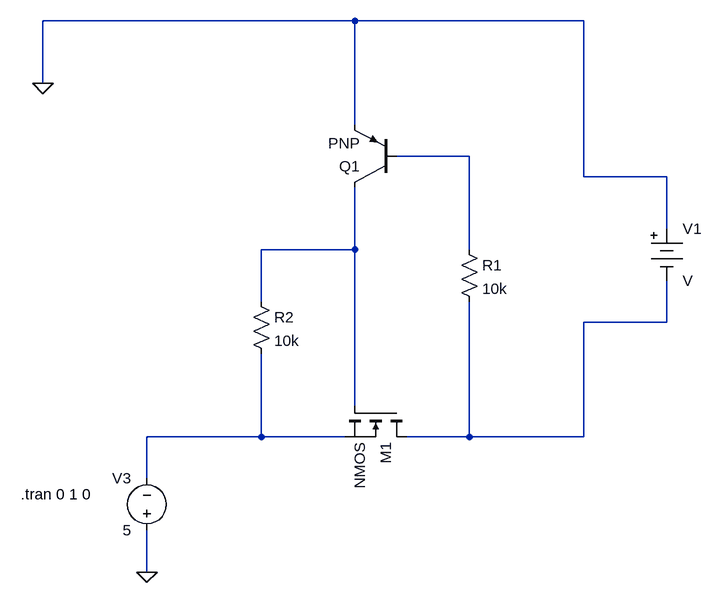
[diagram p0: schematic reverse_voltage_protection_nmos.asc]
reverse_voltage_protection_nmos.asc, the LTspice schematic file:
Version 4
SHEET 1 880 680
WIRE 112 -288 -368 -288
WIRE 464 -288 112 -288
WIRE -368 -192 -368 -288
WIRE 112 -128 112 -288
WIRE 288 -80 176 -80
WIRE 464 -48 464 -288
WIRE 592 -48 464 -48
WIRE 592 32 592 -48
WIRE 112 64 112 -32
WIRE 112 64 -32 64
WIRE 288 64 288 -80
WIRE -32 144 -32 64
WIRE 592 176 592 112
WIRE 592 176 464 176
WIRE 112 304 112 64
WIRE -32 352 -32 224
WIRE -32 352 -208 352
WIRE 96 352 -32 352
WIRE 288 352 288 144
WIRE 288 352 192 352
WIRE 464 352 464 176
WIRE 464 352 288 352
WIRE -208 416 -208 352
WIRE -208 560 -208 496
FLAG -368 -192 0
FLAG -208 560 0
SYMBOL res 272 48 R0
SYMATTR InstName R1
SYMATTR Value 10k
SYMBOL res -48 128 R0
SYMATTR InstName R2
SYMATTR Value 10k
SYMBOL pnp 176 -32 R180
SYMATTR InstName Q1
SYMBOL nmos 192 304 R90
SYMATTR InstName M1
SYMBOL voltage -208 512 R180
WINDOW 0 24 96 Left 2
WINDOW 3 24 16 Left 2
SYMATTR InstName V3
SYMATTR Value 5
SYMBOL Misc\\battery 592 16 R0
SYMATTR InstName V1
TEXT -402 440 Left 2 !.tran 0 1 0

The netlist it stands for:
* reverse_voltage_protection_nmos.asc
R1 N001 N003 10k
R2 N002 N004 10k
Q1 N002 N001 0 0 PNP
M1 N003 N002 N004 N004 NMOS
V3 0 N004 5
V1 0 N003 V
.model NPN NPN
.model PNP PNP
.lib standard.bjt
.model NMOS NMOS
.model PMOS PMOS
.lib standard.mos
.tran 0 1 0
.backanno
.end